# EAGLE design Wireless FanCoil Controller Atmega v2.2 (EAGLE 6.3)
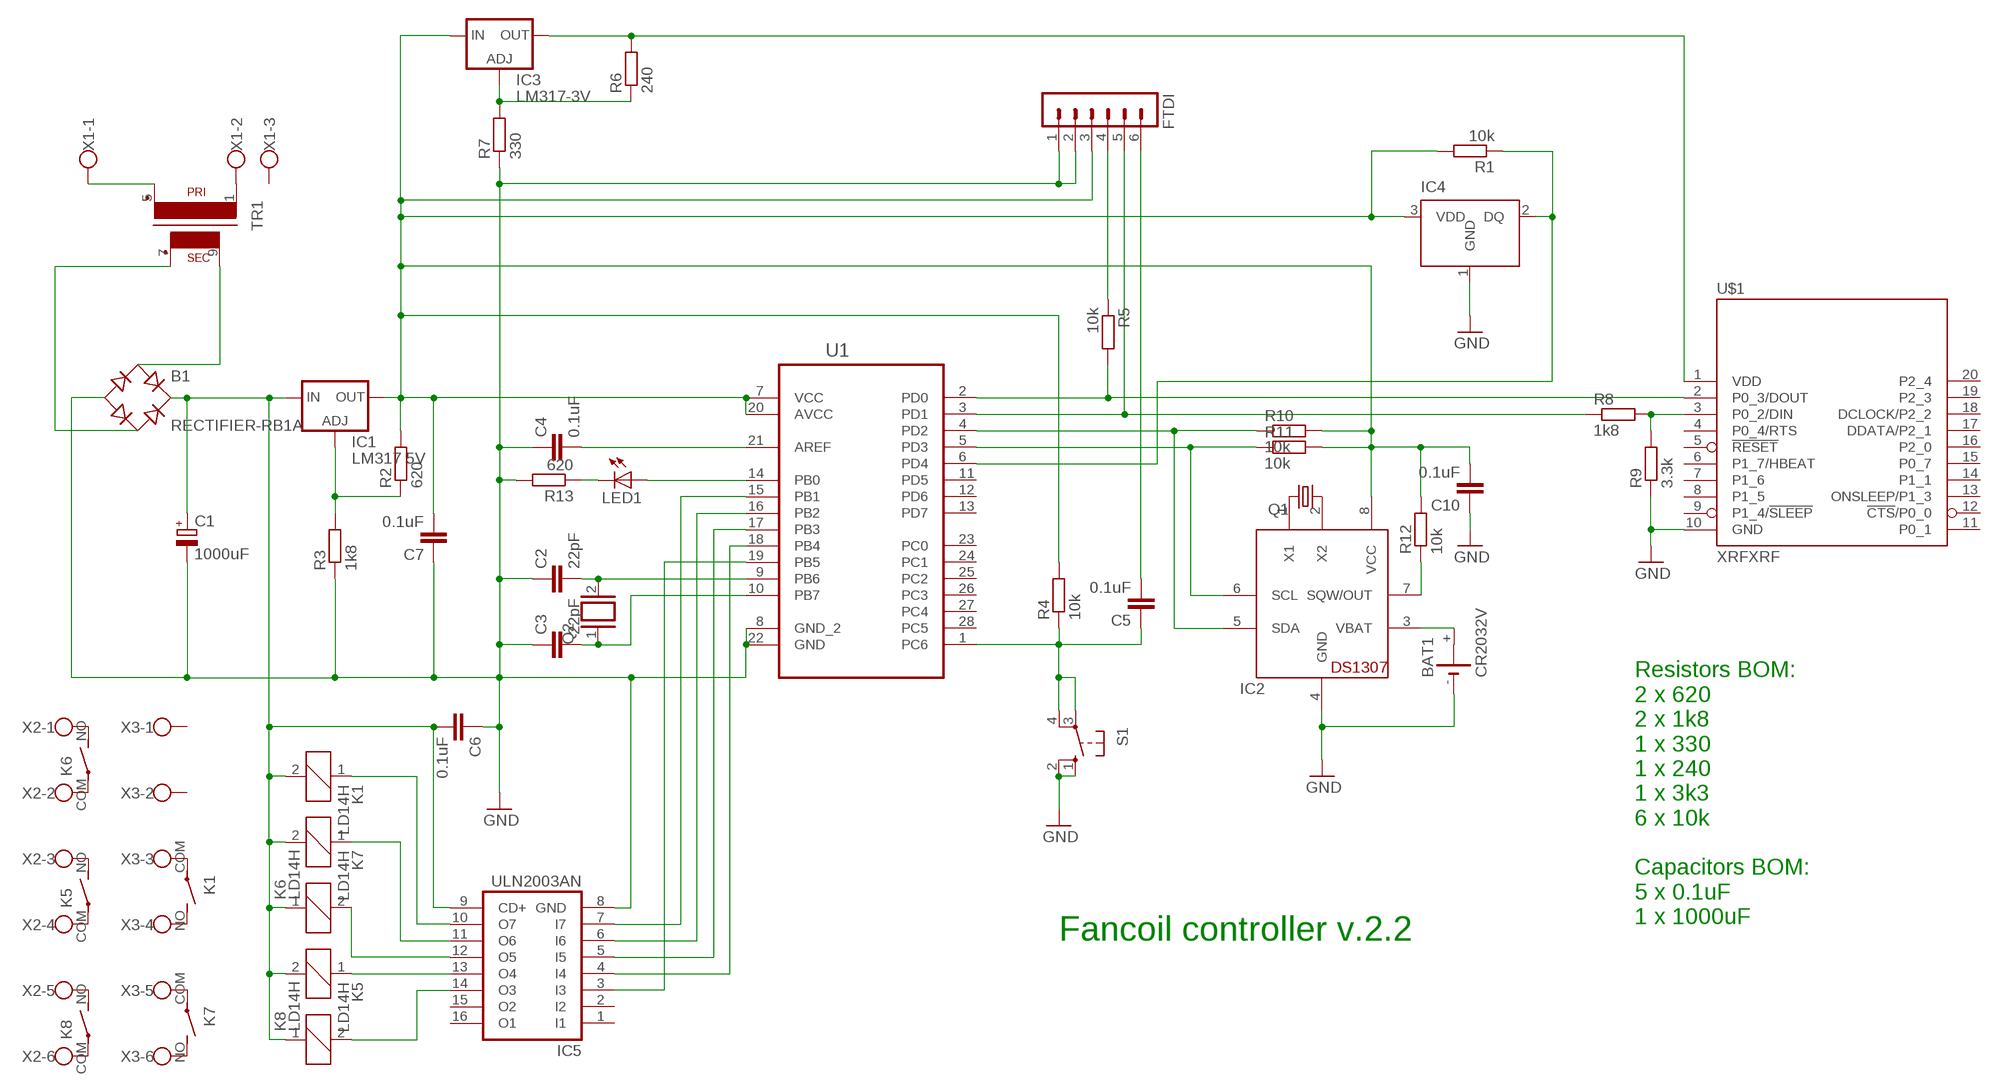
[diagram p0: schematic, sheet 1]

## Parts
B1  RECTIFIER-RB1A  [RB1A]
BAT1  CR2032V  [CR2032V]
C1  1000uF  CPOL-EUE5-10.5  [E5-10,5]
C2  22pF  C-EU025-025X050  [C025-025X050]
C3  22pF  C-EU025-025X050  [C025-025X050]
C4  0.1uF  C-EU050-025X075  [C050-025X075]
C5  0.1uF  C-EU050-025X075  [C050-025X075]
C6  0.1uF  C-EU050-025X075  [C050-025X075]
C7  0.1uF  C-EU050-025X075  [C050-025X075]
C10  0.1uF  C-EU050-025X075  [C050-025X075]
FTDI  MA06-1  [MA06-1]
IC1  LM317 5V  LM317TS  [317TS]
IC2  DS1307  [DIL08]
IC3  LM317-3V  LM317TS  [317TS]
IC4  DS1820  [TO-92]
IC5  ULN2003AN  [DIL16]
K1  LD14H  [LD]
K5  LD14H  [LD]
K6  LD14H  [LD]
K7  LD14H  [LD]
K8  LD14H  [LD]
LED1  LED3MM  [LED3MM]
Q1  CRYSTALTC26H  [TC26H]
Q2  XTAL/S  [QS]
R1  10k  R-EU_0207/5V  [0207/5V]
R2  620  R-EU_0207/5V  [0207/5V]
R3  1k8  R-EU_0207/5V  [0207/5V]
R4  10k  R-EU_0207/5V  [0207/5V]
R5  10k  R-EU_0207/5V  [0207/5V]
R6  240  R-EU_0207/5V  [0207/5V]
R7  330  R-EU_0207/5V  [0207/5V]
R8  1k8  R-EU_0207/12  [0207/12]
R9  3.3k  R-EU_0207/5V  [0207/5V]
R10  10k  R-EU_0207/5V  [0207/5V]
R11  10k  R-EU_0207/5V  [0207/5V]
R12  10k  R-EU_0207/5V  [0207/5V]
R13  620  R-EU_0207/5V  [0207/5V]
S1  10-XX  [B3F-10XX]
TR1  EI30-1  [EI30-1]
U1  ATMEGA328P-PU  [DIP254P762X457-28]
U$1  XRFXRF  [XRF]
X1  W237-103  [W237-103]
X2  W237-136  [W237-136]
X3  W237-136  [W237-136]

## Nets
GND: B1.- BAT1.- C1.- C2.1 C3.1 C4.1 C6.1 C7.1 C10.1 FTDI.1 FTDI.2 IC2.4(GND) IC4.1(GND) IC5.8(GND) R3.1 R7.1 R9.1 R13.2 S1.1(S) S1.2(S1) U1.8(GND_2) U1.22(GND) U$1.10(GND)
LM317-5V: IC1.1(ADJ) R2.1 R3.2
N$1: C4.2 U1.21(AREF)
N$2: C5.2 FTDI.6
N$3: IC2.2(X2) Q1.1
N$4: IC2.1(X1) Q1.2
N$5: IC5.10(O7) K1.1
N$6: IC3.2(OUT) R6.2 U$1.1(VDD)
N$7: C7.2 C10.2 FTDI.3 IC1.2(OUT) IC2.8(VCC) IC3.3(IN) IC4.3(VDD) R1.2 R2.2 R4.2 R10.2 R11.2 R12.2 U1.7(VCC) U1.20(AVCC)
N$8: TR1.1 X1.2
N$9: TR1.5(P2) X1.1
N$10: B1.+ C1.+ C6.2 IC1.3(IN) IC5.9(CD+) K1.2 K5.2 K6.1 K7.2 K8.1
N$11: B1.AC1 TR1.9(S4)
N$12: B1.AC2 TR1.7(S3)
N$13: C2.2 Q2.2 U1.9(PB6)
N$14: C3.2 Q2.1 U1.10(PB7)
N$15: C5.1 R4.1 S1.3(P) S1.4(P1) U1.1(PC6)
N$19: FTDI.4 R5.1
N$20: R5.2 U1.2(PD0) U$1.2(P0_3/DOUT)
N$21: FTDI.5 R8.1 U1.3(PD1)
N$22: IC3.1(ADJ) R6.1 R7.2
N$23: IC2.5(SDA) R10.1 U1.4(PD2)
N$24: R8.2 R9.2 U$1.3(P0_2/DIN)
N$25: IC2.6(SCL) R11.1 U1.5(PD3)
N$26: IC2.7(SQW/OUT) R12.1
N$27: IC4.2(DQ) R1.1 U1.6(PD4)
N$28: IC5.6(I6) U1.16(PB2)
N$29: K8.NO(2:S) X2.5
N$30: IC5.7(I7) U1.15(PB1)
N$33: IC5.4(I4) U1.18(PB4)
N$34: IC5.5(I5) U1.17(PB3)
N$49: IC5.3(I3) U1.19(PB5)
N$50: LED1.K(C) R13.1
N$55: IC5.14(O3) K8.2
N$56: IC5.13(O4) K5.1
N$57: IC5.12(O5) K6.2
N$58: IC5.11(O6) K7.1
N$59: K8.COM(2:P) X2.6
N$60: K5.NO(2:S) X2.3
N$61: K5.COM(2:P) X2.4
N$62: K6.NO(2:S) X2.1
N$65: K6.COM(2:P) X2.2
N$66: K7.COM(2:P) X3.5
N$67: K7.NO(2:S) X3.6
N$68: K1.COM(2:P) X3.3
N$69: LED1.A U1.14(PB0)
N$70: BAT1.+ IC2.3(VBAT)
N$71: K1.NO(2:S) X3.4
Unconnected: BAT1.+@1(+) IC5.1(I1) IC5.2(I2) IC5.15(O2) IC5.16(O1) U1.11(PD5) U1.12(PD6) U1.13(PD7) U1.23(PC0) U1.24(PC1) U1.25(PC2) U1.26(PC3) U1.27(PC4) U1.28(PC5) U$1.4(P0_4/RTS) U$1.5(!RESET) U$1.6(P1_7/HBEAT) U$1.7(P1_6) U$1.8(P1_5) U$1.9(P1_4/!SLEEP) U$1.11(P0_1) U$1.12(!CTS!/P0_0) U$1.13(ONSLEEP/P1_3) U$1.14(P1_1) U$1.15(P0_7) U$1.16(P2_0) U$1.17(DDATA/P2_1) U$1.18(DCLOCK/P2_2) U$1.19(P2_3) U$1.20(P2_4) X1.3 X3.1 X3.2

## Notes on the sheet
- Resistors BOM:
  2 x 620
  2 x 1k8
  1 x 330
  1 x 240
  1 x 3k3
  6 x 10k
  
  Capacitors BOM:
  5 x 0.1uF 
  1 x 1000uF
- Fancoil controller v.2.2

## Library data of the parts
B1 = rectifier:RECTIFIER-: Rectifier
BAT1 = battery:CR2032V: LI BATTERY Varta
C1 = rcl:CPOL-EU: POLARIZED CAPACITOR, European symbol
C2-C7 C10 = rcl:C-EU: CAPACITOR, European symbol
FTDI = con-lstb:MA06-1: PIN HEADER; OC_FARNELL: unknown; OC_NEWARK: unknown
IC1 IC3 = v-reg:LM317TS: VOLTAGE REGULATOR
IC2 = adafruit:DS1307: DS1307 Real time clock (RTC) with battery backup ability. Talk to it via i2c
IC4 = DS1820:DS1820: DS1820 - 1-Wire Digital Thermometer
IC5 = uln-udn:ULN2003A: DRIVER ARRAY
K1 K5-K8 = relay:LD?*: Slim Power Relay NAiS Source: http://www.mew-europe.com/.. en_ds_61112_0000.pdf; MF: FARNELL; MPN: ALD112; OC_FARNELL: 3727166; OC_NEWARK: 70C6003
LED1 = adafruit:LED: LED OSRAM: - CHIPLED LG R971, LG N971, LY N971, LG Q971, LY Q971, LO R971, LY R971 LH N974, LH R974 LS Q976, LO Q976, LY Q976 LO Q996 - Hyper CHIPLED LW Q18S LB Q993, LB Q99A, LB R99A - SideLED LS A670, LO A670, LY A670, LG A670, LP A670 LB A673, LV A673, LT A673, LW A673 LH A674 LY A675 LS A676, LA A676, LO A676, LY A676, LW A676 LS A679, LY A679, LG A679 - Hyper Micro SIDELED® LS Y876, LA Y876, LO Y876, LY Y876 LT Y87S - SmartLED LW L88C, LW L88S LB L89C, LB L89S, LG L890 LS L89K, LO L89K, LY L89K LS L896, LA L896, LO L896, LY L896 - TOPLED LS T670, LO T670, LY T670, LG T670, LP T670 LSG T670, LSP T670, LSY T670, LOP T670, LYG T670 LG T671, LOG T671, LSG T671 LB T673, LV T673, LT T673, LW T673 LH T674 LS T676, LA T676, LO T676, LY T676, LB T676, LH T676, LSB T676, LW T676 LB T67C, LV T67C, LT T67C, LS T67K, LO T67K, LY T67K, LW E67C LS E67B, LA E67B, LO E67B, LY E67B, LB E67C, LV E67C, LT E67C LW T67C LS T679, LY T679, LG T679 LS T770, LO T770, LY T770, LG T770, LP T770 LB T773, LV T773, LT T773, LW T773 LH T774 LS E675, LA E675, LY E675, LS T675 LS T776, LA T776, LO T776, LY T776, LB T776 LHGB T686 LT T68C, LB T68C - Hyper Mini TOPLED® LB M676 - Mini TOPLED Santana® LG M470 LS M47K, LO M47K, LY M47K Source: http://www.osram.convergy.de/
Q1 = crystal:CRYSTAL: CRYSTAL; OC_FARNELL: unknown; OC_NEWARK: unknown
Q2 = special:XTAL/S: CRYSTAL
R1-R13 = rcl:R-EU_: RESISTOR, European symbol
S1 = switch-omron:10-XX: OMRON SWITCH; MPN: B3F-1000; OC_FARNELL: 176432; OC_NEWARK: 36M3542
TR1 = trafo:EI30-1: TRANSFORMER 1 primary winding, 1 secondary winding ERA
U1 = Atmega328p-PU:ATMEGA328P-PU: 8-bit Microcontroller with In-System Programmable Flash; MPN: ATMEGA328P-PU; OC_FARNELL: 1715487; OC_NEWARK: 15R0268; PACKAGE: PDIP-28; SUPPLIER: Atmel
U$1 = Ciseco Footprints:XRF: XRF Wireless UART Serial Data Module. www.ciseco.co.uk
X1 = con-wago-500:W237-103: WAGO SCREW CLAMP; MPN: 237-103; OC_FARNELL: unknown; OC_NEWARK: 18M7116
X2 X3 = con-wago-500:W237-136: WAGO SCREW CLAMP; MPN: 237-136; OC_FARNELL: unknown; OC_NEWARK: 84K9151

## Board
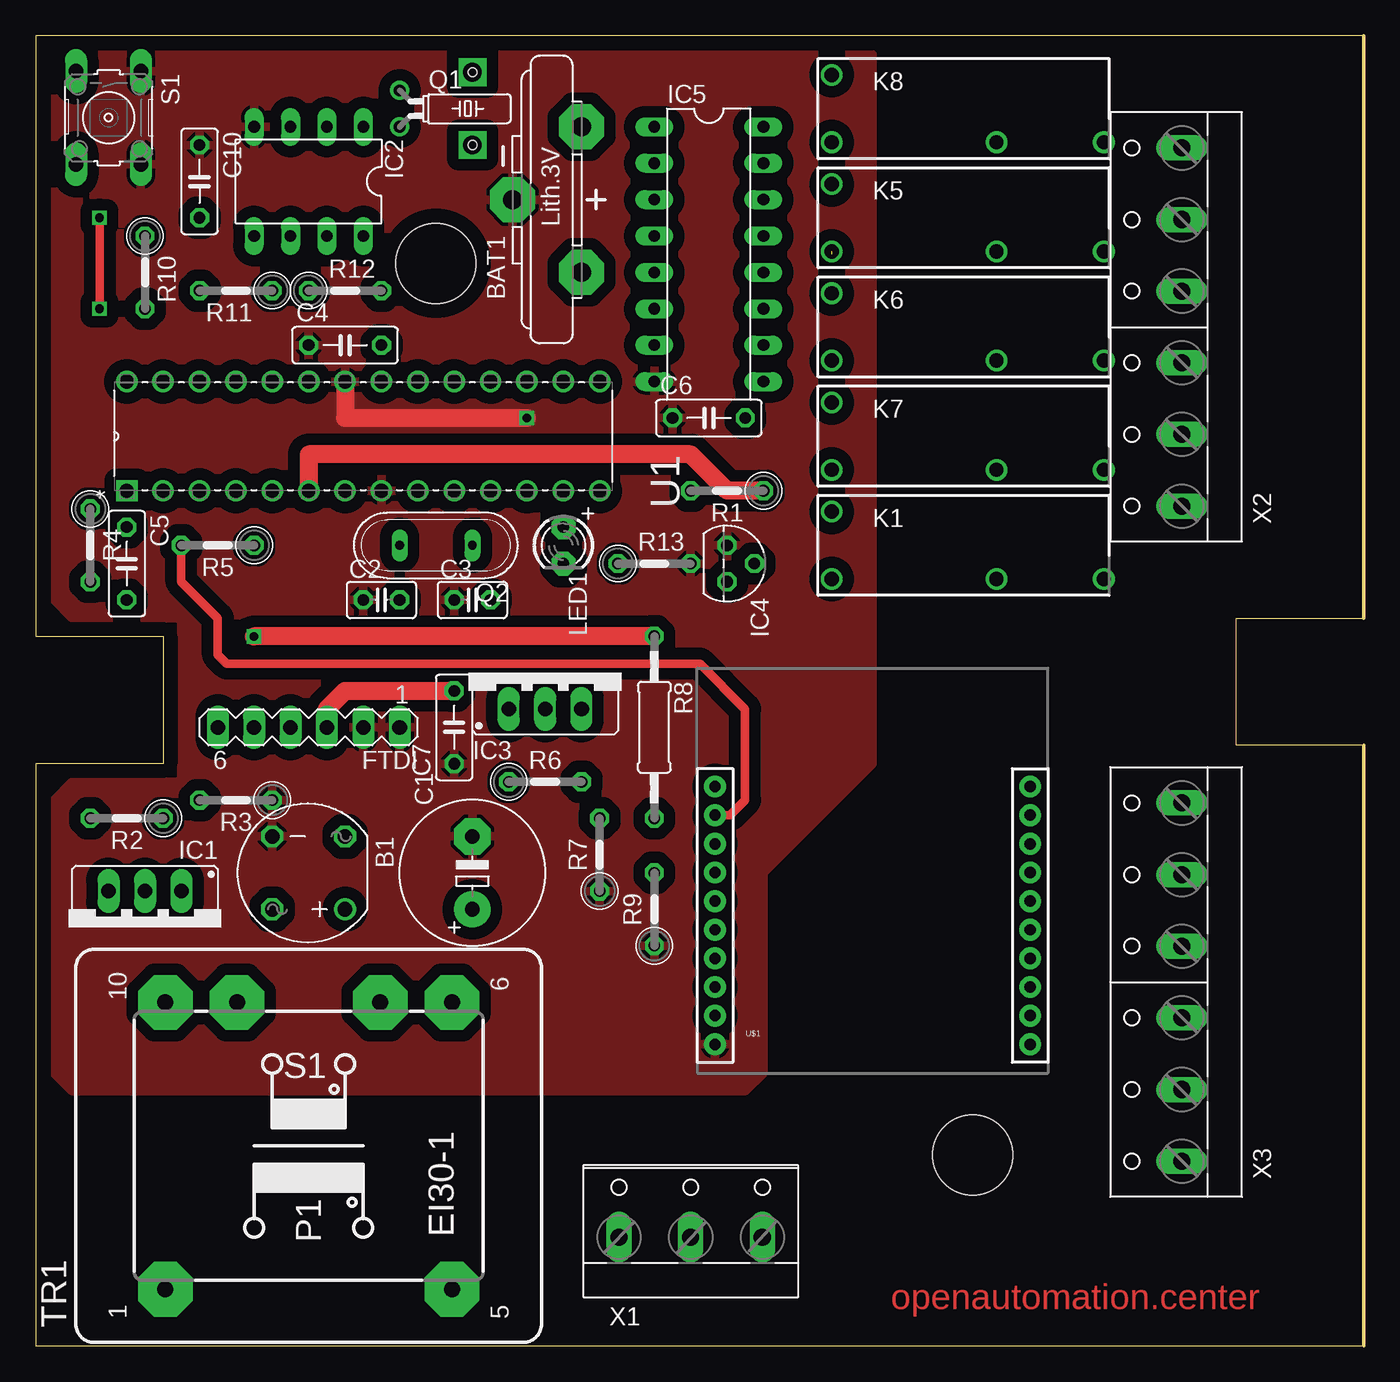
[diagram p1: board, top side]
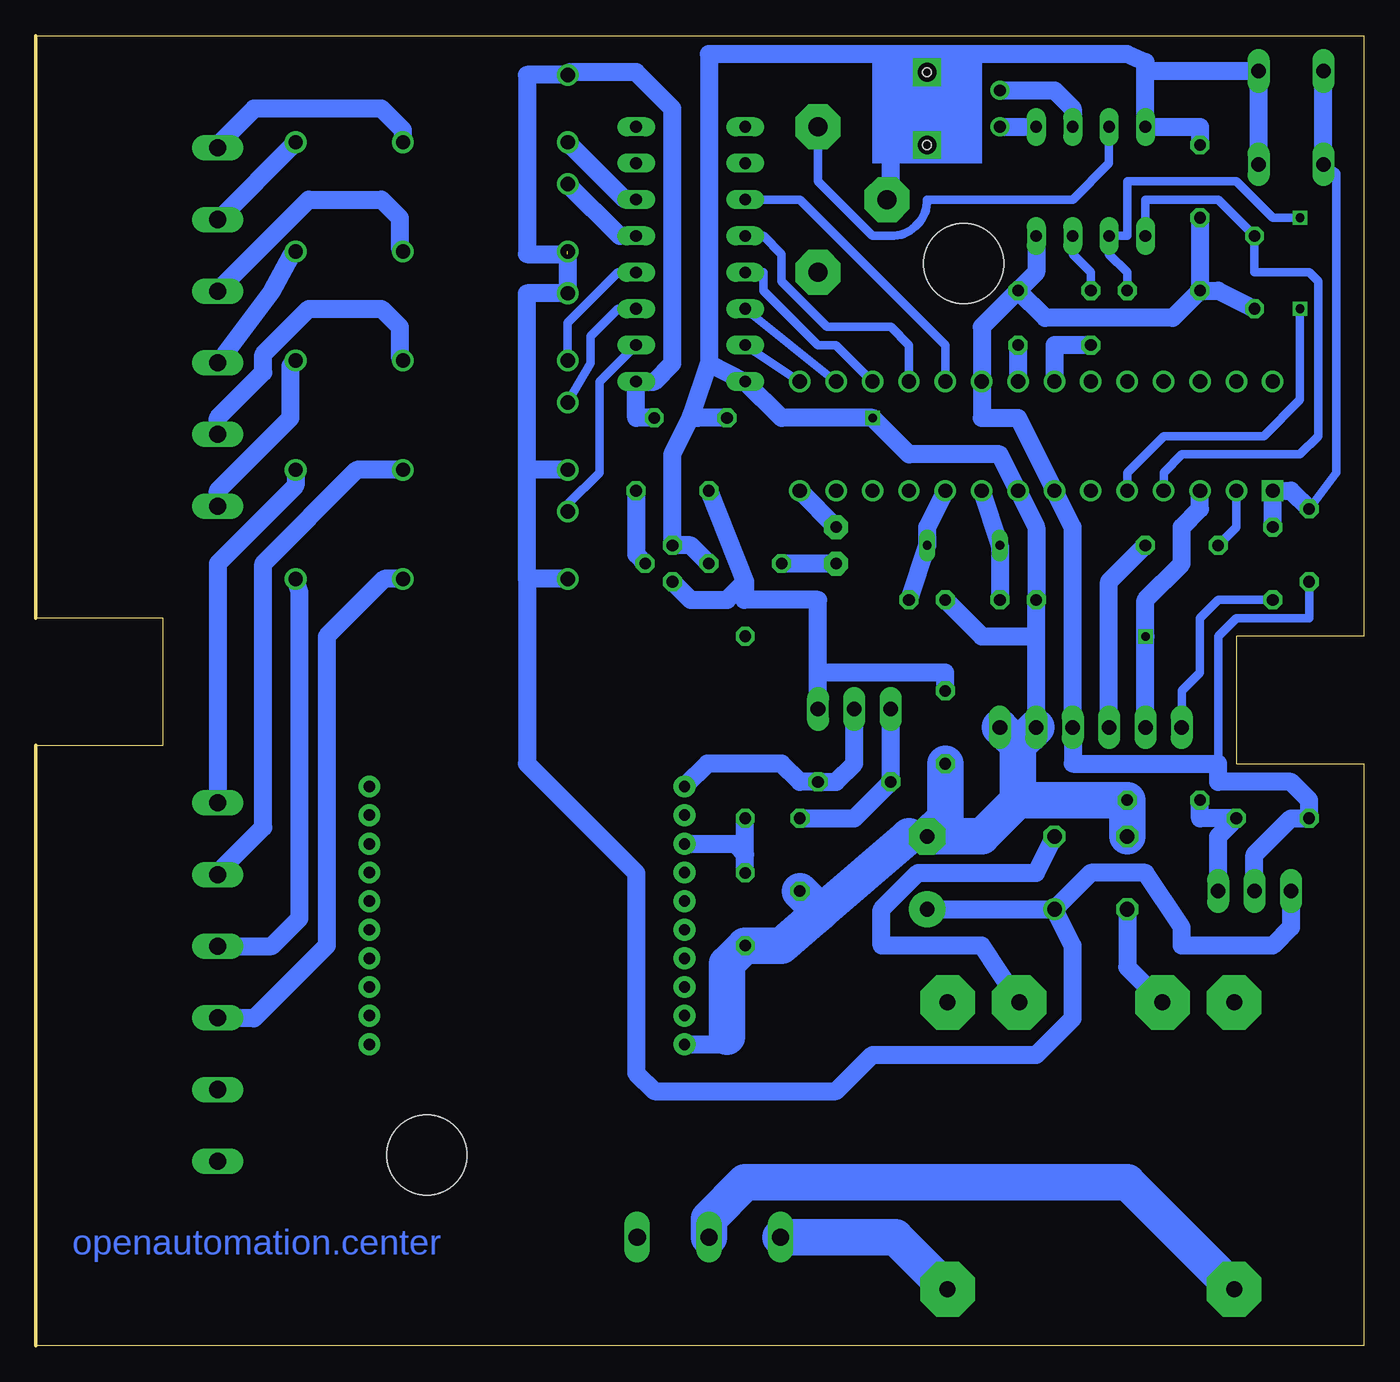
[diagram p2: board, bottom side, seen from below]

Size 92.71 x 91.44 mm. Coordinates in mm from the lower left corner, seen from the top.
Outline: 0,91.44 0,49.53 8.89,49.53 8.89,40.64 0,40.64 0,0 92.71,0 92.71,41.91 83.82,41.91 83.82,50.8 92.71,50.8 92.71,91.44 0,91.44
Copper layers (1*16): Top 0.035mm / dielectric 1.5mm / Bottom 0.035mm
Design rules "default *": minimum track width 10mil, minimum drill 24mil, track to track 12mil, track to pad 12mil, pad to pad 12mil, via to via 12mil, smd to smd 12mil, copper to edge 40mil, drill to drill 8mil, minimum pad ring 10mil, minimum via ring 8mil, stop-mask expansion 4mil, vias tented up to drill 0mil, thermal gap 10mil
Holes 5.59 mm at 65.41,13.34 27.94,75.56
Holes 0.6 mm at 30.48,88.9 30.48,83.82

### Footprints (pad centres in the part's own frame; a part is rotated, then mirrored left to right if it is on the bottom)
RB1A = drill 1.016: + -2.54,2.54 | drill 1.016 octagon: - 2.54,-2.54; AC1 2.54,2.54; AC2 -2.54,-2.54
CR2032V = drill 1.321 pad 3.15 octagon: + -2.54,-5.08; +@1 -2.54,5.08; - 2.286,0
E5-10,5 = drill 1.016 pad 2.54: + -2.54,0 | drill 1.016 pad 2.54 octagon: - 2.54,0
C025-025X050 = drill 0.813 octagon: 1 -1.27,0; 2 1.27,0
C050-025X075 = drill 0.813 octagon: 1 -2.54,0; 2 2.54,0
MA06-1 = drill 1.016 long: 1 -6.35,0; 2 -3.81,0; 3 -1.27,0; 4 1.27,0; 5 3.81,0; 6 6.35,0
317TS = drill 1.016 long: 1 -2.54,-2.54; 2 0,-2.54; 3 2.54,-2.54
DIL08 = drill 0.813 long: 1 -3.81,-3.81; 2 -1.27,-3.81; 3 1.27,-3.81; 4 3.81,-3.81; 5 3.81,3.81; 6 1.27,3.81; 7 -1.27,3.81; 8 -3.81,3.81
TO-92 = drill 0.813 pad 1.27 octagon: 1 -1.27,0; 2 0,1.905; 3 1.27,0
DIL16 = drill 0.813 long: 1 -8.89,-3.81; 2 -6.35,-3.81; 3 -3.81,-3.81; 4 -1.27,-3.81; 5 1.27,-3.81; 6 3.81,-3.81; 7 6.35,-3.81; 8 8.89,-3.81; 9 8.89,3.81; 10 6.35,3.81; 11 3.81,3.81; 12 1.27,3.81; 13 -1.27,3.81; 14 -3.81,3.81; 15 -6.35,3.81; 16 -8.89,3.81
LD = drill 1: 1 -9.2,2.35; 2 -9.2,-2.35; COM 2.3,-2.35; NO 9.8,-2.35
LED3MM = drill 0.813 pad 1.676 octagon: A -1.27,0; K 1.27,0
TC26H = drill 0.813: 1 -1.27,0; 2 1.27,0
QS = drill 0.61 long: 1 -2.54,0; 2 2.54,0
0207/5V = drill 0.813 octagon: 1 -2.54,0; 2 2.54,0
0207/12 = drill 0.813 octagon: 1 -6.35,0; 2 6.35,0
B3F-10XX = drill 1.016 long: 1 -3.251,2.261; 2 3.251,2.261; 3 -3.251,-2.261; 4 3.251,-2.261
EI30-1 = drill 1.118 pad 3.81 octagon: 1 -10.008,10.008; 5 -10.008,-10.008; 6 10.008,-10.008; 7 10.008,-5.004; 9 10.008,5.004; 10 10.008,10.008
DIP254P762X457-28 = drill 0.991 square: 1 -7.62,33.02 | drill 0.991: 2 -7.62,30.48; 3 -7.62,27.94; 4 -7.62,25.4; 5 -7.62,22.86; 6 -7.62,20.32; 7 -7.62,17.78; 8 -7.62,15.24; 9 -7.62,12.7; 10 -7.62,10.16; 11 -7.62,7.62; 12 -7.62,5.08; 13 -7.62,2.54; 14 -7.62,0; 15 0,0; 16 0,2.54; 17 0,5.08; 18 0,7.62; 19 0,10.16; 20 0,12.7; 21 0,15.24; 22 0,17.78; 23 0,20.32; 24 0,22.86; 25 0,25.4; 26 0,27.94; 27 0,30.48; 28 0,33.02
XRF = drill 0.8 pad 1.524: 1 -11,20; 2 -11,18; 3 -11,16; 4 -11,14; 5 -11,12; 6 -11,10; 7 -11,8; 8 -11,6; 9 -11,4; 10 -11,2; 11 11,2; 12 11,4; 13 11,6; 14 11,8; 15 11,10; 16 11,12; 17 11,14; 18 11,16; 19 11,18; 20 11,20
W237-103 = drill 1.194 long: 1 -5,-1.29; 2 0,-1.29; 3 5,-1.29
W237-136 = drill 1.194 long: 1 -12.5,-1.27; 2 -7.5,-1.27; 3 -2.5,-1.27; 4 2.5,-1.27; 5 7.5,-1.27; 6 12.5,-1.27

### Placement (x,y rotation side)
B1  19.05,33.02 180 top
BAT1  35.56,80.01 180 top
C1  30.48,33.02 90 top
C2  24.13,52.07 0 top
C3  30.48,52.07 0 top
C4  21.59,69.85 0 top
C5  6.35,54.61 270 top
C6  46.99,64.77 0 top
C7  29.21,43.18 90 top
C10  11.43,81.28 270 top
FTDI  19.05,43.18 180 top
IC1  7.62,29.21 180 top
IC2  19.05,81.28 180 top
IC3  35.56,46.99 0 top
IC4  48.26,54.61 270 top
IC5  46.99,76.2 270 top
K1  64.77,55.88 0 top
K5  64.77,78.74 0 top
K6  64.77,71.12 0 top
K7  64.77,63.5 0 top
K8  64.77,86.36 0 top
LED1  36.83,55.88 270 top
Q1  25.4,86.36 270 top
Q2  27.94,55.88 180 top
R1  48.26,59.69 180 top
R2  6.35,36.83 180 top
R3  13.97,38.1 180 top
R4  3.81,55.88 270 top
R5  12.7,55.88 180 top
R6  35.56,39.37 0 top
R7  39.37,34.29 90 top
R8  43.18,43.18 270 top
R9  43.18,30.48 90 top
R10  7.62,74.93 270 top
R11  13.97,73.66 180 top
R12  21.59,73.66 0 top
R13  43.18,54.61 0 top
S1  5.08,85.72 270 top
TR1  19.05,13.97 90 top
U1  39.37,67.31 90 top
U$1  58.42,19.05 0 top
X1  45.72,8.89 0 top
X2  78.74,71.12 90 top
X3  78.74,25.4 90 top

### Tracks (layer width: path | path; a pad name or v marks a point on that pad's centre or on a via)
GND  (via drill 0.6)
  Top 1.27: U1.22 21.59,64.77 v34.29,64.77
  Bottom 1.27: 15.24,88.9 IC2.4 11.43,85.09 C10.1 | 15.24,88.9 15.24,89.61 16.51,90.17 33.02,90.17 | 33.02,90.17 45.72,90.17 45.72,68.58 | 45.72,68.58 IC5.8 40.64,64.77 v34.29,64.77 31.75,62.23 25.4,62.23 U1.8 22.86,57.15 C2.1 22.86,49.53 | C1.- 31.75,35.56 | S1.2 S1.1 15.16,88.98 15.24,88.9 | U$1.10 44.99,21.05 44.45,21.59 | FTDI.2 22.86,49.53 | C3.1 26.67,49.53 22.86,49.53 | 46.86,65.15 46.99,64.77 48.26,62.23 IC4.1 46.99,55.88 R13.2 | 46.86,65.15 45.72,68.58 | 33.02,80.01 33.02,90.17 | C4.1 21.59,69.85 U1.22 | C6.1 46.48,64.77 46.86,65.15
  Bottom 2.54: 31.75,35.56 37.92,30.27 | 37.92,30.27 38.55,29.73 40.64,27.94 R9.1 44.45,26.67 44.45,21.59 | 24.13,38.1 26.67,35.56 C1.- 29.21,36.83 C7.1 | 24.13,38.1 24.13,41.91 | 24.13,41.91 FTDI.1 | 24.13,41.91 FTDI.2 | R7.1 39.37,31.72 37.92,30.27 | B1.- R3.1 24.13,38.1
  pour Top (isolate 0.813): 1.27,90.17 58.42,90.17 58.42,40.64 50.8,33.02 50.8,19.05 49.53,17.78 2.54,17.78 1.27,19.05 1.27,38.1 2.54,39.37 10.16,39.37 10.16,50.8 2.54,50.8 1.27,52.07
LM317-5V
  Bottom 1.27: IC1.1 10.16,35.56 R2.1 11.43,36.83 R3.2
N$1
  Bottom 1.27: C4.2 U1.21
N$2
  Bottom 0.61: FTDI.6 12.7,45.72 11.43,46.99 11.43,50.8 10.16,52.07 C5.2
N$3
  Bottom 1.27: Q1.1 21.59,87.63 20.32,86.36 IC2.2
N$4
  Bottom 1.27: Q1.2 IC2.1
N$5
  Bottom 0.61: K1.1 55.57,58.73 53.34,60.96 53.34,67.31 IC5.10
N$6
  Bottom 1.27: IC3.2 35.56,40.64 36.83,39.37 R6.2 39.37,39.37 40.64,40.64 45.83,40.64 U$1.1
N$7
  Top 1.27: FTDI.3 20.32,44.45 21.59,45.72 C7.2
  Bottom 0.61: 10.16,40.64 10.16,49.53 8.89,50.8 3.81,50.8 R4.2
  Bottom 1.27: 38.1,46.99 38.1,52.07 43.26,52.08 43.18,52.79 43.18,53.34 | C7.2 29.21,46.99 38.1,46.99 | R1.2 43.18,53.34 | R10.2 10.16,73.66 R11.2 | IC2.8 22.86,74.93 R12.2 | C10.2 R11.2 | R11.2 13.34,71.75 22.23,71.75 R12.2 | IC1.2 7.62,34.29 5.08,36.83 R2.2 3.81,38.1 5.08,39.37 10.16,39.37 10.16,40.64 20.32,40.64 FTDI.3 20.32,57.15 U1.7 24.13,64.77 26.67,64.77 U1.20 26.67,71.12 R12.2 | IC4.3 46.99,52.07 44.45,52.07 43.18,53.34 | IC3.3 38.1,46.99
N$8
  Bottom 2.54: X1.2 45.72,8.89 43.18,11.43 16.51,11.43 TR1.1
N$9
  Bottom 2.54: X1.1 32.7,7.6 TR1.5
N$10  (1 unrouted)
  Bottom 1.27: C1.+ B1.+ | IC1.3 5.08,29.21 6.35,27.94 12.7,27.94 12.7,29.21 15.24,33.02 19.05,33.02 B1.+ | K7.2 58.42,61.15 | 58.42,61.15 58.42,73.47 K6.1 55.57,76.2 58.42,76.2 58.42,88.71 K8.1 55.38,88.9 50.8,88.9 48.26,86.36 48.26,68.58 49.53,67.31 IC5.9 50.8,64.77 C6.2 | 58.42,53.53 58.42,61.15 | K1.2 58.42,53.53 | 58.42,53.53 58.42,40.64 50.8,33.02 50.8,19.05 49.53,17.78 36.83,17.78 34.29,20.32 22.86,20.32 20.32,22.86 20.32,27.94 B1.+
N$11
  Bottom 1.27: B1.AC1 16.51,26.44 TR1.9
N$12
  Bottom 0.254: 24.13,24.13 TR1.7
  Bottom 1.27: B1.AC2 22.86,33.02 31.11,33.02 33.66,30.48 33.66,27.94 26.67,27.94 24.13,24.13
N$13
  Bottom 1.27: U1.9 Q2.2 C2.2
N$14
  Bottom 1.27: U1.10 30.48,57.15 Q2.1 C3.2
N$15
  Bottom 0.61: S1.4 1.91,81.84 1.91,60.96 R4.1
  Bottom 1.27: S1.4 S1.3 | C5.1 U1.1 5.08,59.69 R4.1
N$19
  Bottom 1.27: FTDI.4 17.78,53.34 R5.1
N$20
  Top 0.61: U$1.2 48.48,37.05 49.53,38.1 49.53,44.45 46.35,47.62 13.34,47.62 12.7,48.26 12.7,50.8 10.16,53.34 R5.2
  Bottom 0.61: R5.2 8.89,57.15 U1.2
N$21  (via drill 0.6)
  Top 1.27: R8.1 v15.24,49.53
  Bottom 1.27: FTDI.5 v15.24,49.53 15.24,52.07 12.7,54.61 12.7,57.15 11.43,58.42 U1.3
N$22
  Bottom 1.27: R7.2 35.56,36.83 R6.1 IC3.1
N$23
  Bottom 0.61: IC2.5 15.24,80.01 10.16,80.01 R10.1 7.62,74.93 3.81,74.93 3.17,74.3 3.17,63.5 4.45,62.23 12.7,62.23 13.97,60.96 U1.4
N$24
  Bottom 1.27: R9.2 43.18,34.29 | 43.18,34.29 R8.2 | U$1.3 43.94,35.05 43.18,34.29
N$25  (via drill 0.6)
  Top 0.61: v4.45,78.74 v4.45,72.39
  Bottom 0.61: R11.1 16.51,74.93 17.78,76.2 IC2.6 16.51,77.47 16.51,81.28 8.89,81.28 6.35,78.74 v4.45,78.74 | U1.5 16.51,60.96 13.97,63.5 6.99,63.5 4.45,66.04 v4.45,72.39
N$26
  Bottom 0.61: R12.1 19.05,74.93 20.32,76.2 IC2.7
N$27
  Top 1.27: R1.1 48.26,59.69 45.72,62.23 19.05,62.23 U1.6
  Bottom 1.27: R1.1 50.8,55.25 IC4.2
N$28
  Bottom 0.61: U1.16 IC5.6
N$29
  Bottom 1.27: X2.5 79.96,78.62 K8.NO
N$30
  Bottom 0.61: U1.15 IC5.7
N$33
  Bottom 0.61: IC5.4 41.91,77.47 40.64,76.2 40.64,74.3 37.47,71.12 33.02,71.12 31.75,69.85 U1.18
N$34
  Bottom 0.61: IC5.5 41.91,74.93 41.91,73.66 38.1,69.85 36.83,69.85 U1.17
N$49
  Bottom 0.61: IC5.3 39.37,80.01 29.21,69.85 U1.19
N$50
  Bottom 1.27: LED1.K R13.1
N$55
  Bottom 1.27: IC5.14 51.57,80.01 K8.2
N$56
  Bottom 1.27: IC5.13 51.95,77.47 K5.1
N$57
  Bottom 0.61: K6.2 55.57,71.43 52.07,74.93 IC5.12
N$58
  Bottom 0.61: IC5.11 52.07,72.39 53.98,70.48 53.98,68.58 K7.1
N$59
  Bottom 1.27: K8.COM 67.07,84.85 68.58,86.36 77.47,86.36 80.01,83.82 81.08,83.82 X2.6
N$60
  Bottom 1.27: X2.3 79.97,68.62 76.2,73.66 74.93,76.03 K5.NO
N$61
  Bottom 1.27: X2.4 80.01,73.66 73.66,80.01 68.58,80.01 67.31,78.74 67.31,76.63 K5.COM
N$62
  Bottom 1.27: X2.1 80.01,59.69 74.93,64.77 74.93,68.41 K6.NO
N$63  (via drill 1.3)
  other vias: 30.48,88.9
N$64  (via drill 1.3)
  other vias: 30.48,83.82
N$65
  Bottom 1.27: X2.2 80.01,64.77 76.83,67.94 76.83,69.22 73.66,72.39 68.58,72.39 67.31,71.12 67.31,69.01 K6.COM
N$66
  Bottom 1.27: X3.5 80.01,33.02 76.83,36.2 76.83,54.61 70.3,61.15 K7.COM
N$67
  Bottom 1.27: K7.NO 74.57,60.05 80.01,54.61 X3.6
N$68
  Bottom 1.27: K1.COM 68.39,53.53 72.39,49.53 72.39,27.94 77.47,22.86 79.97,22.86 X3.3
N$69
  Bottom 1.27: U1.14 LED1.A
N$70
  Bottom 0.61: BAT1.+ 38.1,81.28 34.29,77.47 33.02,77.47 arc-90 30.48,80.01 20.32,80.01 17.78,82.55 IC2.3
N$71
  Bottom 1.27: K1.NO 74.3,52.62 74.3,29.84 76.24,27.9 X3.4
(copper drawn outside any net)
  shapes: Bottom area x1

### Text on the board
Top: openautomation.center
Bottom: openautomation.center